# Altium schematic sheet DDR4_SODIMM2.SchDoc: DDR4 SODIMM CONNECTOR1
size C; DocumentNumber: 4; SheetNumber: 4; SheetTotal: 46
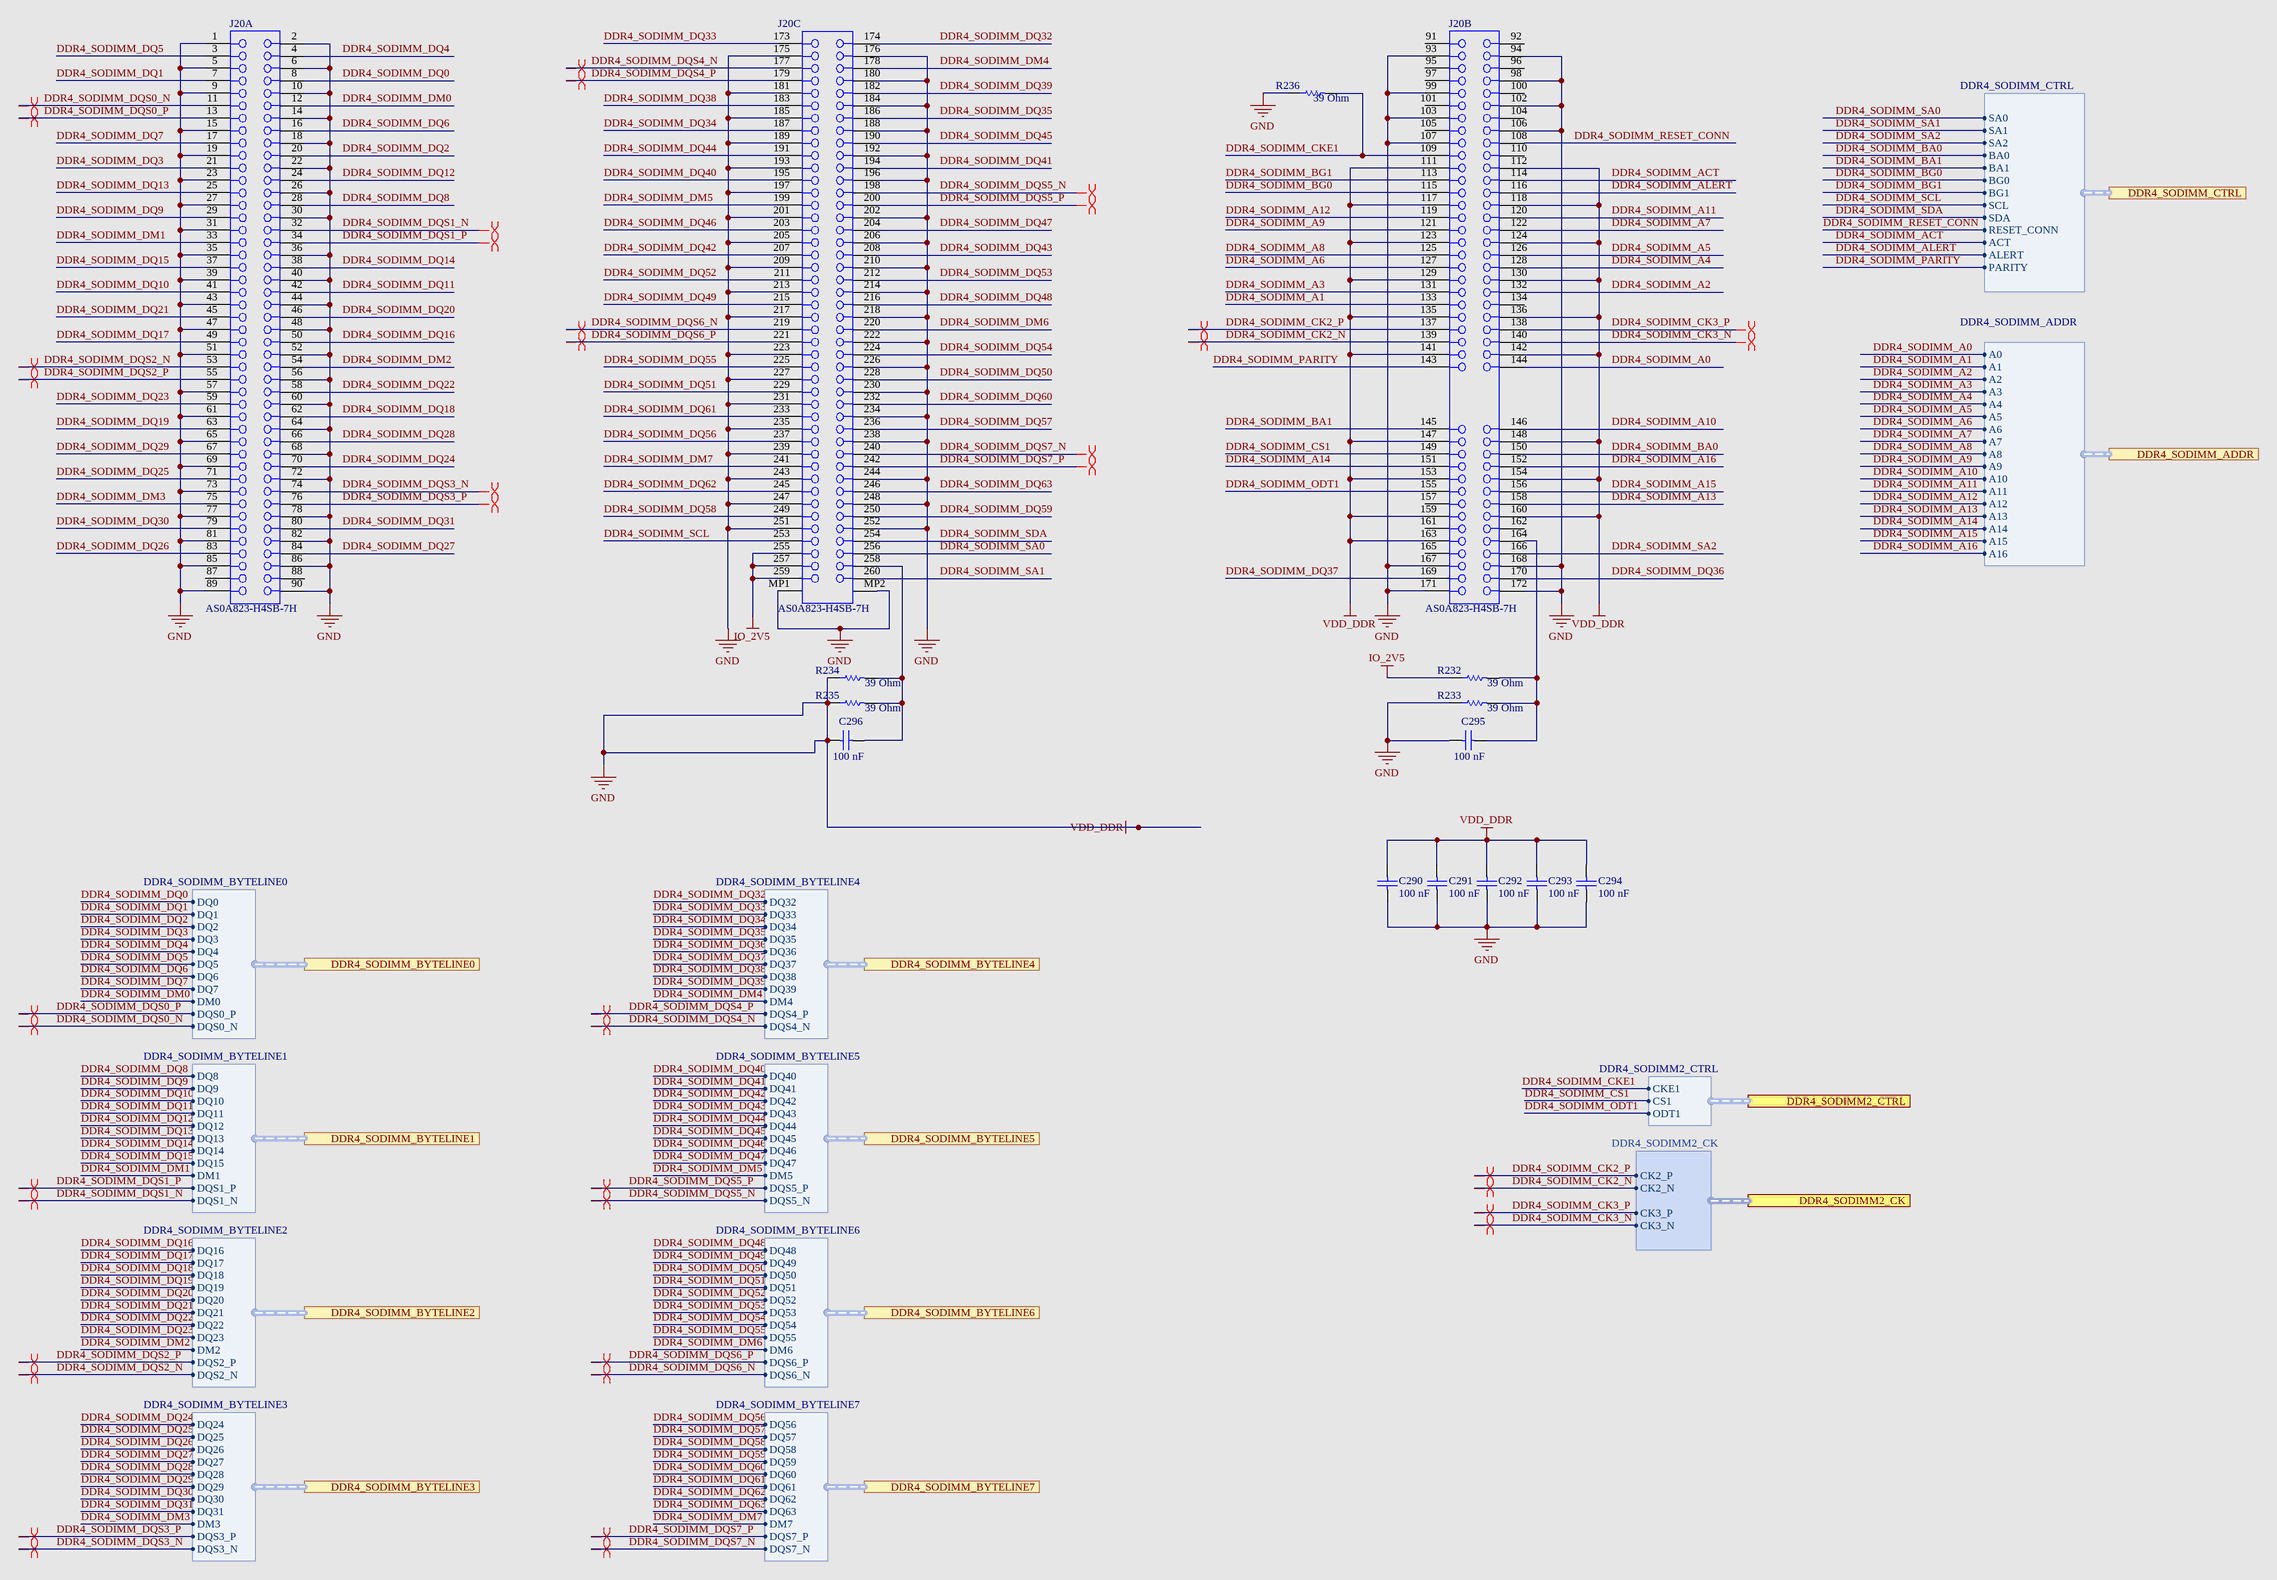
[diagram p0: DDR4_SODIMM2.SchDoc]

## Parts
C290  Capacitance: 100 nF  [CAPC1005X55X10LL05]  (hidden comment: C1005X7R1E104M)
C291  Capacitance: 100 nF  [CAPC1005X55X10LL05]  (hidden comment: C1005X7R1E104M)
C292  Capacitance: 100 nF  [CAPC1005X55X10LL05]  (hidden comment: C1005X7R1E104M)
C293  Capacitance: 100 nF  [CAPC1005X55X10LL05]  (hidden comment: C1005X7R1E104M)
C294  Capacitance: 100 nF  [CAPC1005X55X10LL05]  (hidden comment: C1005X7R1E104M)
C295  Capacitance: 100 nF  [CAPC1005X55X10LL05]  (hidden comment: C1005X7R1E104M)
C296  Capacitance: 100 nF  [CAPC1005X55X10LL05]  (hidden comment: C1005X7R1E104M)
J20  AS0A823-H4SB-7H  [FOXC-AS0A823-H4SB-7H_V]  (parts A,B,C of 3)
R232  Resistance: 39 Ohm  [RESC1005X35X25NL8T10]  (hidden comment: NRC04F49R9TRF)
R233  Resistance: 39 Ohm  [RESC1005X35X25NL8T10]  (hidden comment: NRC04F49R9TRF)
R234  Resistance: 39 Ohm  [RESC1005X35X25NL8T10]  (hidden comment: NRC04F49R9TRF)
R235  Resistance: 39 Ohm  [RESC1005X35X25NL8T10]  (hidden comment: NRC04F49R9TRF)
R236  Resistance: 39 Ohm  [RESC1005X40X25NL5T10]  (hidden comment: RC0402JR-0739RL)

## Ports
DDR4_SODIMM2_CK (harness DDR4_SODIMM2_CK), DDR4_SODIMM2_CTRL (harness DDR4_SODIMM2_CTRL), DDR4_SODIMM_ADDR (harness DDR4_SODIMM_ADDR), DDR4_SODIMM_BYTELINE0 (harness DDR4_SODIMM_BYTELINE0), DDR4_SODIMM_BYTELINE1 (harness DDR4_SODIMM_BYTELINE1), DDR4_SODIMM_BYTELINE2 (harness DDR4_SODIMM_BYTELINE2), DDR4_SODIMM_BYTELINE3 (harness DDR4_SODIMM_BYTELINE3), DDR4_SODIMM_BYTELINE4 (harness DDR4_SODIMM_BYTELINE4), DDR4_SODIMM_BYTELINE5 (harness DDR4_SODIMM_BYTELINE5), DDR4_SODIMM_BYTELINE6 (harness DDR4_SODIMM_BYTELINE6), DDR4_SODIMM_BYTELINE7 (harness DDR4_SODIMM_BYTELINE7), DDR4_SODIMM_CTRL (harness DDR4_SODIMM_CTRL)

## Harnesses
DDR4_SODIMM_CTRL: SA0, SA1, SA2, BA0, BA1, BG0, BG1, SCL, SDA, RESET_CONN, ACT, ALERT, PARITY
DDR4_SODIMM_ADDR: A0, A2, A1, A3, A4, A5, A6, A7, A9, A8, A10, A11, A12, A13, A14, A15, A16
DDR4_SODIMM_BYTELINE0: DQ0, DQ1, DQ2, DQ3, DQ4, DQ5, DQ6, DQ7, DM0, DQS0_P, DQS0_N
DDR4_SODIMM_BYTELINE1: DQ8, DQ9, DQ10, DQ11, DQ12, DQ13, DQ14, DQ15, DM1, DQS1_P, DQS1_N
DDR4_SODIMM_BYTELINE2: DQ16, DQ17, DQ18, DQ19, DQ20, DQ21, DQ22, DQ23, DM2, DQS2_P, DQS2_N
DDR4_SODIMM_BYTELINE3: DQ24, DQ25, DQ26, DQ27, DQ28, DQ29, DQ30, DQ31, DM3, DQS3_P, DQS3_N
DDR4_SODIMM_BYTELINE4: DQ32, DQ33, DQ34, DQ35, DQ36, DQ37, DQ38, DQ39, DM4, DQS4_P, DQS4_N
DDR4_SODIMM_BYTELINE5: DQ40, DQ41, DQ42, DQ43, DQ44, DQ45, DQ46, DQ47, DM5, DQS5_P, DQS5_N
DDR4_SODIMM_BYTELINE6: DQ48, DQ49, DQ50, DQ51, DQ52, DQ53, DQ54, DQ55, DM6, DQS6_P, DQS6_N
DDR4_SODIMM_BYTELINE7: DQ56, DQ57, DQ58, DQ59, DQ60, DQ61, DQ62, DQ63, DM7, DQS7_P, DQS7_N
DDR4_SODIMM2_CTRL: CKE1, CS1, ODT1
DDR4_SODIMM2_CK: CK2_P, CK2_N, CK3_P, CK3_N

## Nets
GND: C290.1 C290.2 C291.1 C291.2 C292.1 C292.2 C293.1 C293.2 C294.1 C294.2 C295.2 C296.2 J20.1 J20.2 J20.5 J20.6 J20.9 J20.10 J20.14 J20.15 J20.18 J20.19 J20.22 J20.23 J20.26 J20.27 J20.30 J20.31 J20.35 J20.36 J20.39 J20.40 J20.43 J20.44 J20.47 J20.48 J20.51 J20.52 J20.56 J20.57 J20.60 J20.61 J20.64 J20.65 J20.68 J20.69 J20.72 J20.73 J20.77 J20.78 J20.81 J20.82 J20.85 J20.86 J20.89 J20.90 J20.93 J20.94 J20.98 J20.99 J20.102 J20.103 J20.106 J20.107 J20.111 J20.112 J20.117 J20.118 J20.123 J20.124 J20.129 J20.130 J20.135 J20.136 J20.141 J20.142 J20.147 J20.148 J20.153 J20.154 J20.159 J20.160 J20.163 J20.167 J20.168 J20.171 J20.172 J20.175 J20.176 J20.180 J20.181 J20.184 J20.185 J20.188 J20.189 J20.192 J20.193 J20.196 J20.197 J20.201 J20.202 J20.205 J20.206 J20.209 J20.210 J20.213 J20.214 J20.217 J20.218 J20.222 J20.223 J20.226 J20.227 J20.230 J20.231 J20.234 J20.235 J20.238 J20.239 J20.243 J20.244 J20.247 J20.248 J20.251 J20.252 J20.MP1 J20.MP2 R233.1 R234.1 R235.1 R236.1  [also labelled VDD_DDR]
IO_2V5: J20.255 J20.257 J20.259 R232.1
DDR4_SODIMM_A0: J20.144 ; port DDR4_SODIMM_ADDR.A0
DDR4_SODIMM_A1: J20.133 ; port DDR4_SODIMM_ADDR.A1
DDR4_SODIMM_A2: J20.132 ; port DDR4_SODIMM_ADDR.A2
DDR4_SODIMM_A3: J20.131 ; port DDR4_SODIMM_ADDR.A3
DDR4_SODIMM_A4: J20.128 ; port DDR4_SODIMM_ADDR.A4
DDR4_SODIMM_A5: J20.126 ; port DDR4_SODIMM_ADDR.A5
DDR4_SODIMM_A6: J20.127 ; port DDR4_SODIMM_ADDR.A6
DDR4_SODIMM_A7: J20.122 ; port DDR4_SODIMM_ADDR.A7
DDR4_SODIMM_A8: J20.125 ; port DDR4_SODIMM_ADDR.A8
DDR4_SODIMM_A9: J20.121 ; port DDR4_SODIMM_ADDR.A9
DDR4_SODIMM_A10: J20.146 ; port DDR4_SODIMM_ADDR.A10
DDR4_SODIMM_A11: J20.120 ; port DDR4_SODIMM_ADDR.A11
DDR4_SODIMM_A12: J20.119 ; port DDR4_SODIMM_ADDR.A12
DDR4_SODIMM_A13: J20.158 ; port DDR4_SODIMM_ADDR.A13
DDR4_SODIMM_A14: J20.151 ; port DDR4_SODIMM_ADDR.A14
DDR4_SODIMM_A15: J20.156 ; port DDR4_SODIMM_ADDR.A15
DDR4_SODIMM_A16: J20.152 ; port DDR4_SODIMM_ADDR.A16
DDR4_SODIMM_ACT: J20.114 ; port DDR4_SODIMM_CTRL.ACT
DDR4_SODIMM_ALERT: J20.116 ; port DDR4_SODIMM_CTRL.ALERT
DDR4_SODIMM_BA0: J20.150 ; port DDR4_SODIMM_CTRL.BA0
DDR4_SODIMM_BA1: J20.145 ; port DDR4_SODIMM_CTRL.BA1
DDR4_SODIMM_BG0: J20.115 ; port DDR4_SODIMM_CTRL.BG0
DDR4_SODIMM_BG1: J20.113 ; port DDR4_SODIMM_CTRL.BG1
DDR4_SODIMM_CK2_N: J20.139 ; port DDR4_SODIMM2_CK.CK2_N
DDR4_SODIMM_CK2_P: J20.137 ; port DDR4_SODIMM2_CK.CK2_P
DDR4_SODIMM_CK3_N: J20.140 ; port DDR4_SODIMM2_CK.CK3_N
DDR4_SODIMM_CK3_P: J20.138 ; port DDR4_SODIMM2_CK.CK3_P
DDR4_SODIMM_CKE1: J20.109 R236.2 ; port DDR4_SODIMM2_CTRL.CKE1
DDR4_SODIMM_CS1: J20.149 ; port DDR4_SODIMM2_CTRL.CS1
DDR4_SODIMM_DM0: J20.12 ; port DDR4_SODIMM_BYTELINE0.DM0
DDR4_SODIMM_DM1: J20.33 ; port DDR4_SODIMM_BYTELINE1.DM1
DDR4_SODIMM_DM2: J20.54 ; port DDR4_SODIMM_BYTELINE2.DM2
DDR4_SODIMM_DM3: J20.75 ; port DDR4_SODIMM_BYTELINE3.DM3
DDR4_SODIMM_DM4: J20.178 ; port DDR4_SODIMM_BYTELINE4.DM4
DDR4_SODIMM_DM5: J20.199 ; port DDR4_SODIMM_BYTELINE5.DM5
DDR4_SODIMM_DM6: J20.220 ; port DDR4_SODIMM_BYTELINE6.DM6
DDR4_SODIMM_DM7: J20.241 ; port DDR4_SODIMM_BYTELINE7.DM7
DDR4_SODIMM_DQ0: J20.8 ; port DDR4_SODIMM_BYTELINE0.DQ0
DDR4_SODIMM_DQ1: J20.7 ; port DDR4_SODIMM_BYTELINE0.DQ1
DDR4_SODIMM_DQ2: J20.20 ; port DDR4_SODIMM_BYTELINE0.DQ2
DDR4_SODIMM_DQ3: J20.21 ; port DDR4_SODIMM_BYTELINE0.DQ3
DDR4_SODIMM_DQ4: J20.4 ; port DDR4_SODIMM_BYTELINE0.DQ4
DDR4_SODIMM_DQ5: J20.3 ; port DDR4_SODIMM_BYTELINE0.DQ5
DDR4_SODIMM_DQ6: J20.16 ; port DDR4_SODIMM_BYTELINE0.DQ6
DDR4_SODIMM_DQ7: J20.17 ; port DDR4_SODIMM_BYTELINE0.DQ7
DDR4_SODIMM_DQ8: J20.28 ; port DDR4_SODIMM_BYTELINE1.DQ8
DDR4_SODIMM_DQ9: J20.29 ; port DDR4_SODIMM_BYTELINE1.DQ9
DDR4_SODIMM_DQ10: J20.41 ; port DDR4_SODIMM_BYTELINE1.DQ10
DDR4_SODIMM_DQ11: J20.42 ; port DDR4_SODIMM_BYTELINE1.DQ11
DDR4_SODIMM_DQ12: J20.24 ; port DDR4_SODIMM_BYTELINE1.DQ12
DDR4_SODIMM_DQ13: J20.25 ; port DDR4_SODIMM_BYTELINE1.DQ13
DDR4_SODIMM_DQ14: J20.38 ; port DDR4_SODIMM_BYTELINE1.DQ14
DDR4_SODIMM_DQ15: J20.37 ; port DDR4_SODIMM_BYTELINE1.DQ15
DDR4_SODIMM_DQ16: J20.50 ; port DDR4_SODIMM_BYTELINE2.DQ16
DDR4_SODIMM_DQ17: J20.49 ; port DDR4_SODIMM_BYTELINE2.DQ17
DDR4_SODIMM_DQ18: J20.62 ; port DDR4_SODIMM_BYTELINE2.DQ18
DDR4_SODIMM_DQ19: J20.63 ; port DDR4_SODIMM_BYTELINE2.DQ19
DDR4_SODIMM_DQ20: J20.46 ; port DDR4_SODIMM_BYTELINE2.DQ20
DDR4_SODIMM_DQ21: J20.45 ; port DDR4_SODIMM_BYTELINE2.DQ21
DDR4_SODIMM_DQ22: J20.58 ; port DDR4_SODIMM_BYTELINE2.DQ22
DDR4_SODIMM_DQ23: J20.59 ; port DDR4_SODIMM_BYTELINE2.DQ23
DDR4_SODIMM_DQ24: J20.70 ; port DDR4_SODIMM_BYTELINE3.DQ24
DDR4_SODIMM_DQ25: J20.71 ; port DDR4_SODIMM_BYTELINE3.DQ25
DDR4_SODIMM_DQ26: J20.83 ; port DDR4_SODIMM_BYTELINE3.DQ26
DDR4_SODIMM_DQ27: J20.84 ; port DDR4_SODIMM_BYTELINE3.DQ27
DDR4_SODIMM_DQ28: J20.66 ; port DDR4_SODIMM_BYTELINE3.DQ28
DDR4_SODIMM_DQ29: J20.67 ; port DDR4_SODIMM_BYTELINE3.DQ29
DDR4_SODIMM_DQ30: J20.79 ; port DDR4_SODIMM_BYTELINE3.DQ30
DDR4_SODIMM_DQ31: J20.80 ; port DDR4_SODIMM_BYTELINE3.DQ31
DDR4_SODIMM_DQ32: J20.174 ; port DDR4_SODIMM_BYTELINE4.DQ32
DDR4_SODIMM_DQ33: J20.173 ; port DDR4_SODIMM_BYTELINE4.DQ33
DDR4_SODIMM_DQ34: J20.187 ; port DDR4_SODIMM_BYTELINE4.DQ34
DDR4_SODIMM_DQ35: J20.186 ; port DDR4_SODIMM_BYTELINE4.DQ35
DDR4_SODIMM_DQ36: J20.170 ; port DDR4_SODIMM_BYTELINE4.DQ36
DDR4_SODIMM_DQ37: J20.169 ; port DDR4_SODIMM_BYTELINE4.DQ37
DDR4_SODIMM_DQ38: J20.183 ; port DDR4_SODIMM_BYTELINE4.DQ38
DDR4_SODIMM_DQ39: J20.182 ; port DDR4_SODIMM_BYTELINE4.DQ39
DDR4_SODIMM_DQ40: J20.195 ; port DDR4_SODIMM_BYTELINE5.DQ40
DDR4_SODIMM_DQ41: J20.194 ; port DDR4_SODIMM_BYTELINE5.DQ41
DDR4_SODIMM_DQ42: J20.207 ; port DDR4_SODIMM_BYTELINE5.DQ42
DDR4_SODIMM_DQ43: J20.208 ; port DDR4_SODIMM_BYTELINE5.DQ43
DDR4_SODIMM_DQ44: J20.191 ; port DDR4_SODIMM_BYTELINE5.DQ44
DDR4_SODIMM_DQ45: J20.190 ; port DDR4_SODIMM_BYTELINE5.DQ45
DDR4_SODIMM_DQ46: J20.203 ; port DDR4_SODIMM_BYTELINE5.DQ46
DDR4_SODIMM_DQ47: J20.204 ; port DDR4_SODIMM_BYTELINE5.DQ47
DDR4_SODIMM_DQ48: J20.216 ; port DDR4_SODIMM_BYTELINE6.DQ48
DDR4_SODIMM_DQ49: J20.215 ; port DDR4_SODIMM_BYTELINE6.DQ49
DDR4_SODIMM_DQ50: J20.228 ; port DDR4_SODIMM_BYTELINE6.DQ50
DDR4_SODIMM_DQ51: J20.229 ; port DDR4_SODIMM_BYTELINE6.DQ51
DDR4_SODIMM_DQ52: J20.211 ; port DDR4_SODIMM_BYTELINE6.DQ52
DDR4_SODIMM_DQ53: J20.212 ; port DDR4_SODIMM_BYTELINE6.DQ53
DDR4_SODIMM_DQ54: J20.224 ; port DDR4_SODIMM_BYTELINE6.DQ54
DDR4_SODIMM_DQ55: J20.225 ; port DDR4_SODIMM_BYTELINE6.DQ55
DDR4_SODIMM_DQ56: J20.237 ; port DDR4_SODIMM_BYTELINE7.DQ56
DDR4_SODIMM_DQ57: J20.236 ; port DDR4_SODIMM_BYTELINE7.DQ57
DDR4_SODIMM_DQ58: J20.249 ; port DDR4_SODIMM_BYTELINE7.DQ58
DDR4_SODIMM_DQ59: J20.250 ; port DDR4_SODIMM_BYTELINE7.DQ59
DDR4_SODIMM_DQ60: J20.232 ; port DDR4_SODIMM_BYTELINE7.DQ60
DDR4_SODIMM_DQ61: J20.233 ; port DDR4_SODIMM_BYTELINE7.DQ61
DDR4_SODIMM_DQ62: J20.245 ; port DDR4_SODIMM_BYTELINE7.DQ62
DDR4_SODIMM_DQ63: J20.246 ; port DDR4_SODIMM_BYTELINE7.DQ63
DDR4_SODIMM_DQS0_N: J20.11 ; port DDR4_SODIMM_BYTELINE0.DQS0_N
DDR4_SODIMM_DQS0_P: J20.13 ; port DDR4_SODIMM_BYTELINE0.DQS0_P
DDR4_SODIMM_DQS1_N: J20.32 ; port DDR4_SODIMM_BYTELINE1.DQS1_N
DDR4_SODIMM_DQS1_P: J20.34 ; port DDR4_SODIMM_BYTELINE1.DQS1_P
DDR4_SODIMM_DQS2_N: J20.53 ; port DDR4_SODIMM_BYTELINE2.DQS2_N
DDR4_SODIMM_DQS2_P: J20.55 ; port DDR4_SODIMM_BYTELINE2.DQS2_P
DDR4_SODIMM_DQS3_N: J20.74 ; port DDR4_SODIMM_BYTELINE3.DQS3_N
DDR4_SODIMM_DQS3_P: J20.76 ; port DDR4_SODIMM_BYTELINE3.DQS3_P
DDR4_SODIMM_DQS4_N: J20.177 ; port DDR4_SODIMM_BYTELINE4.DQS4_N
DDR4_SODIMM_DQS4_P: J20.179 ; port DDR4_SODIMM_BYTELINE4.DQS4_P
DDR4_SODIMM_DQS5_N: J20.198 ; port DDR4_SODIMM_BYTELINE5.DQS5_N
DDR4_SODIMM_DQS5_P: J20.200 ; port DDR4_SODIMM_BYTELINE5.DQS5_P
DDR4_SODIMM_DQS6_N: J20.219 ; port DDR4_SODIMM_BYTELINE6.DQS6_N
DDR4_SODIMM_DQS6_P: J20.221 ; port DDR4_SODIMM_BYTELINE6.DQS6_P
DDR4_SODIMM_DQS7_N: J20.240 ; port DDR4_SODIMM_BYTELINE7.DQS7_N
DDR4_SODIMM_DQS7_P: J20.242 ; port DDR4_SODIMM_BYTELINE7.DQS7_P
DDR4_SODIMM_ODT1: J20.155 ; port DDR4_SODIMM2_CTRL.ODT1
DDR4_SODIMM_PARITY: J20.143 ; port DDR4_SODIMM_CTRL.PARITY
DDR4_SODIMM_RESET_CONN: J20.108 ; port DDR4_SODIMM_CTRL.RESET_CONN
DDR4_SODIMM_SA0: J20.256 ; port DDR4_SODIMM_CTRL.SA0
DDR4_SODIMM_SA1: J20.260 ; port DDR4_SODIMM_CTRL.SA1
DDR4_SODIMM_SA2: J20.166 ; port DDR4_SODIMM_CTRL.SA2
DDR4_SODIMM_SCL: J20.253 ; port DDR4_SODIMM_CTRL.SCL
DDR4_SODIMM_SDA: J20.254 ; port DDR4_SODIMM_CTRL.SDA
NetC295_1: C295.1 J20.164 R232.2 R233.2
NetC296_1: C296.1 J20.258 R234.2 R235.2

Not connected (* = marked no-connect by the designer): J20 87 88 91 92 95 96 97 100 101 104 105 110 134 157 161 162 165

## Layout directives
differential pair: DDR4_SODIMM_CK2_N, DDR4_SODIMM_CK2_P, DDR4_SODIMM_CK3_N, DDR4_SODIMM_CK3_P, DDR4_SODIMM_DQS0_N, DDR4_SODIMM_DQS0_P, DDR4_SODIMM_DQS1_N, DDR4_SODIMM_DQS1_P, DDR4_SODIMM_DQS2_N, DDR4_SODIMM_DQS2_P, DDR4_SODIMM_DQS3_N, DDR4_SODIMM_DQS3_P, DDR4_SODIMM_DQS4_N, DDR4_SODIMM_DQS4_P, DDR4_SODIMM_DQS5_N, DDR4_SODIMM_DQS5_P, DDR4_SODIMM_DQS6_N, DDR4_SODIMM_DQS6_P, DDR4_SODIMM_DQS7_N, DDR4_SODIMM_DQS7_P

## Notes on the sheet
- Title
- Size:
- Date:
- File:
- B
- Number:
- Time:
- Revision:
- Sheet
- of

## Library data of the parts
C290-C296 = CMP-1663-00009-2: Chip Capacitor, 0.1 uF, +/- 20%, 25 V, -55 to 125 degC, 0402 (1005 Metric), RoHS, Tape and Reel; Type (Capacitors): X7R; Voltage Rating: 25 V; Case\/Package: 0402; Tolerance: 20%; Mounting Technology: Surface Mount; Max Operating Temperature: 125 degC; ComponentLink2URL: http://www.farnell.com/datasheets/1571323.pdf; ComponentLink1URL: http://www.tdk.com/; RoHSCompliant: true; Packaging: Tape and Reel; ComponentLink2Description: Datasheet; Case Code (Imperial): 0402; DatasheetVersion: 09/2011; ComponentLink1Description: Manufacturer URL; PackageDescription: 2-Pin Surface Mount Device, Body 1 x 0.5 mm; PackageReference: 0402; Min Operating Temperature: -55 degC; Case Code (Metric): 1005; Height: 0.5 mm; Package Quantity: 10000; Width: 0.5 mm; Pins: 2; Voltage Rating (DC): 25 V; PartNumber: C1005X7R1E104M; Mount: Surface Mount; Length: 1 mm
J20 = CMP-1735-00001-2: Surface Mount Horizontal Type DDR4 DIMM Socket Connector, 260 Position, Pitch 0.5 mm, -55 to 85 degC, Halogen/Lead Free, Tape and Reel; Mounting Technology: Surface Mount; ComponentLink1URL: http://www.foxconn.com/; ComponentLink2URL: https://drive.google.com/drive/folders/0By4GUdJb-DJ9Um5lRWw4YjB4d2c; PackageDescription: 260-Pin Surface Mount Device, Body Length 73.1 mm, Pitch 0.5 mm; PartNumber: AS0A823-H4SB-7H; DatasheetVersion: Rev. A, 10/2013; ComponentLink1Description: Manufacturer URL; ComponentLink2Description: Datasheet; System: Connector
R232-R235 = CMP-2002-07994-2: Chip Resistor, 39 Ohm, +/- 5%, 0.063 W, -55 to 155 degC, 0402 (1005 Metric), RoHS, Tape and Reel; PartNumber: RC0402JR-0739RL; Power Rating: 63 mW; Voltage Rating (DC): 50 V; Case Code (Imperial): 0402; Mount: Surface Mount; Max Operating Temperature: 155 degC; Case Code (Metric): 1005; ComponentLink1Description: Manufacturer URL; PackageDescription: 2-Pin Surface Mount Device, Body 1 x 0.5 mm; ComponentLink2Description: Datasheet; Tolerance: 5%; Height: 0.35 mm; Pins: 2; Min Operating Temperature: -55 degC; Length: 1 mm; DatasheetVersion: Rev. 4, 02/2016; ComponentLink2URL: http://www.yageo.com/documents/recent/PYu-RC_Group_51_RoHS_L_04.pdf; Mounting Technology: Surface Mount; Packaging: Cut Tape; Case/Package: 0402; Package Quantity: 1; RoHSCompliant: true; REACH SVHC: No SVHC; Width: 0.5 mm; Voltage Rating: 50 V; ComponentLink1URL: http://www.yageo.com/
R236 = CMP-2002-07994-2: Chip Resistor, 39 Ohm, +/- 5%, 0.063 W, -55 to 155 degC, 0402 (1005 Metric), RoHS, Tape and Reel; Power Rating: 63 mW; Voltage Rating (DC): 50 V; Case Code (Imperial): 0402; Mount: Surface Mount; Max Operating Temperature: 155 degC; Case Code (Metric): 1005; ComponentLink1Description: Manufacturer URL; PackageDescription: 2-Pin Surface Mount Device, Body 1 x 0.5 mm; PartNumber: RC0402JR-0739RL; ComponentLink2Description: Datasheet; Tolerance: 5%; Height: 0.35 mm; Pins: 2; Min Operating Temperature: -55 degC; Length: 1 mm; DatasheetVersion: Rev. 4, 02/2016; ComponentLink2URL: http://www.yageo.com/documents/recent/PYu-RC_Group_51_RoHS_L_04.pdf; Mounting Technology: Surface Mount; Packaging: Cut Tape; Case/Package: 0402; Package Quantity: 1; RoHSCompliant: true; REACH SVHC: No SVHC; Width: 0.5 mm; Voltage Rating: 50 V; ComponentLink1URL: http://www.yageo.com/